# EAGLE design ver1 (EAGLE 9.0.0)
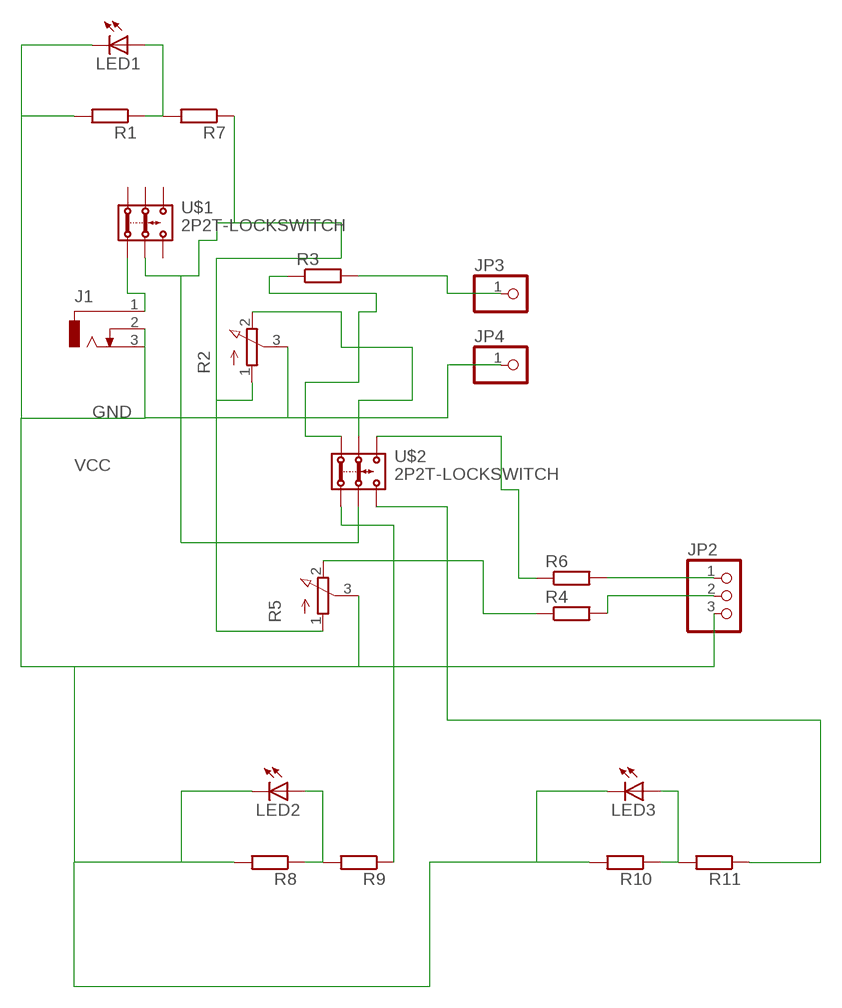
[diagram p0: schematic, sheet 1]

## Parts
J1  DCJ0303  [DCJ0303]
JP2  PINHD-1X3  [1X03]
JP3  PINHD-1X11X01_CHANDIMA  [1X01_CHANDIMA]
JP4  PINHD-1X11X01_CHANDIMA  [1X01_CHANDIMA]
LED1  LEDLED5MM-CHANDIMA  [LED5MM-CHANDIMA]
LED2  LEDLED5MM-CHANDIMA  [LED5MM-CHANDIMA]
LED3  LEDLED5MM-CHANDIMA  [LED5MM-CHANDIMA]
R1  R-EU_0207/10_CHANDIMA  [0207/10_CHANDIMA]
R2  3RP/1610N3RP_CHANDIMA  [3RP/1610N_CHANDIMA]
R3  R-EU_0207/10_CHANDIMA  [0207/10_CHANDIMA]
R4  R-EU_0207/10_CHANDIMA  [0207/10_CHANDIMA]
R5  3RP/1610N3RP_CHANDIMA  [3RP/1610N_CHANDIMA]
R6  R-EU_0207/10_CHANDIMA  [0207/10_CHANDIMA]
R7  R-EU_0207/10_CHANDIMA  [0207/10_CHANDIMA]
R8  R-EU_0207/10_CHANDIMA  [0207/10_CHANDIMA]
R9  R-EU_0207/10_CHANDIMA  [0207/10_CHANDIMA]
R10  R-EU_0207/10_CHANDIMA  [0207/10_CHANDIMA]
R11  R-EU_0207/10_CHANDIMA  [0207/10_CHANDIMA]
U$1  2P2T-LOCKSWITCH  [2P2T-LOCKSWITCH]
U$2  2P2T-LOCKSWITCH  [2P2T-LOCKSWITCH]

## Nets
GND: J1.2 J1.3 JP2.3 JP4.1 LED1.K(C) LED2.K(C) LED3.K(C) R1.2 R2.3(S) R5.3(S) R8.2 R10.2
N$1: R2.2(E) U$2.2.1
N$2: LED1.A R1.1 R7.2
N$3: R6.1 U$2.3.1
N$4: J1.1 U$1.1.2
N$5: JP3.1 R3.2
N$6: LED3.A R10.1 R11.2
N$7: JP2.1 R6.2
N$8: R3.1 U$2.1.1
N$9: JP2.2 R4.2
N$10: R4.1 R5.2(E)
N$11: R9.1 U$2.1.2
N$12: LED2.A R8.1 R9.2
N$13: R11.1 U$2.3.2
VCC: R2.1(A) R5.1(A) R7.1 U$1.2.2 U$2.2.2
Unconnected: U$1.1.1 U$1.2.1 U$1.3.1 U$1.3.2

## Library data of the parts
J1 = con-jack:DCJ0303: DC POWER JACK Source: DCJ0303.pdf; OC_FARNELL: unknown; OC_NEWARK: unknown
JP2 = pinhead:PINHD-1X3: PIN HEADER
JP3 JP4 = pinhead:PINHD-1X1: PIN HEADER
LED1-LED3 = led:LED: LED OSRAM: - CHIPLED LG R971, LG N971, LY N971, LG Q971, LY Q971, LO R971, LY R971 LH N974, LH R974 LS Q976, LO Q976, LY Q976 LO Q996 - Hyper CHIPLED LW Q18S LB Q993, LB Q99A, LB R99A - SideLED LS A670, LO A670, LY A670, LG A670, LP A670 LB A673, LV A673, LT A673, LW A673 LH A674 LY A675 LS A676, LA A676, LO A676, LY A676, LW A676 LS A679, LY A679, LG A679 - Hyper Micro SIDELED® LS Y876, LA Y876, LO Y876, LY Y876 LT Y87S - SmartLED LW L88C, LW L88S LB L89C, LB L89S, LG L890 LS L89K, LO L89K, LY L89K LS L896, LA L896, LO L896, LY L896 - TOPLED LS T670, LO T670, LY T670, LG T670, LP T670 LSG T670, LSP T670, LSY T670, LOP T670, LYG T670 LG T671, LOG T671, LSG T671 LB T673, LV T673, LT T673, LW T673 LH T674 LS T676, LA T676, LO T676, LY T676, LB T676, LH T676, LSB T676, LW T676 LB T67C, LV T67C, LT T67C, LS T67K, LO T67K, LY T67K, LW E67C LS E67B, LA E67B, LO E67B, LY E67B, LB E67C, LV E67C, LT E67C LW T67C LS T679, LY T679, LG T679 LS T770, LO T770, LY T770, LG T770, LP T770 LB T773, LV T773, LT T773, LW T773 LH T774 LS E675, LA E675, LY E675, LS T675 LS T776, LA T776, LO T776, LY T776, LB T776 LHGB T686 LT T68C, LB T68C - Hyper Mini TOPLED® LB M676 - Mini TOPLED Santana® LG M470 LS M47K, LO M47K, LY M47K Source: http://www.osram.convergy.de LUXEON: - LUMILED® LXK2-PW12-R00, LXK2-PW12-S00, LXK2-PW14-U00, LXK2-PW14-V00 LXK2-PM12-R00, LXK2-PM12-S00, LXK2-PM14-U00 LXK2-PE12-Q00, LXK2-PE12-R00, LXK2-PE12-S00, LXK2-PE14-T00, LXK2-PE14-U00 LXK2-PB12-K00, LXK2-PB12-L00, LXK2-PB12-M00, LXK2-PB14-N00, LXK2-PB14-P00, LXK2-PB14-Q00 LXK2-PR12-L00, LXK2-PR12-M00, LXK2-PR14-Q00, LXK2-PR14-R00 LXK2-PD12-Q00, LXK2-PD12-R00, LXK2-PD12-S00 LXK2-PH12-R00, LXK2-PH12-S00 LXK2-PL12-P00, LXK2-PL12-Q00, LXK2-PL12-R00 Source: www.luxeon.com KINGBRIGHT: KA-3528ASYC Source: www.kingbright.com
R1 R3 R4 R6-R11 = rcl:R-EU_: RESISTOR, European symbol
R2 R5 = pot:3RP/1610N: 16mm Potentiometer one level Source: http://www.alphapotentiometers.net/html/16mm_pot_2.html
U$1 U$2 = switch:2P2T-LOCKSWITCH

## Net classes
0 default: width 1.016 mm, clearance 1.27 mm

## Board
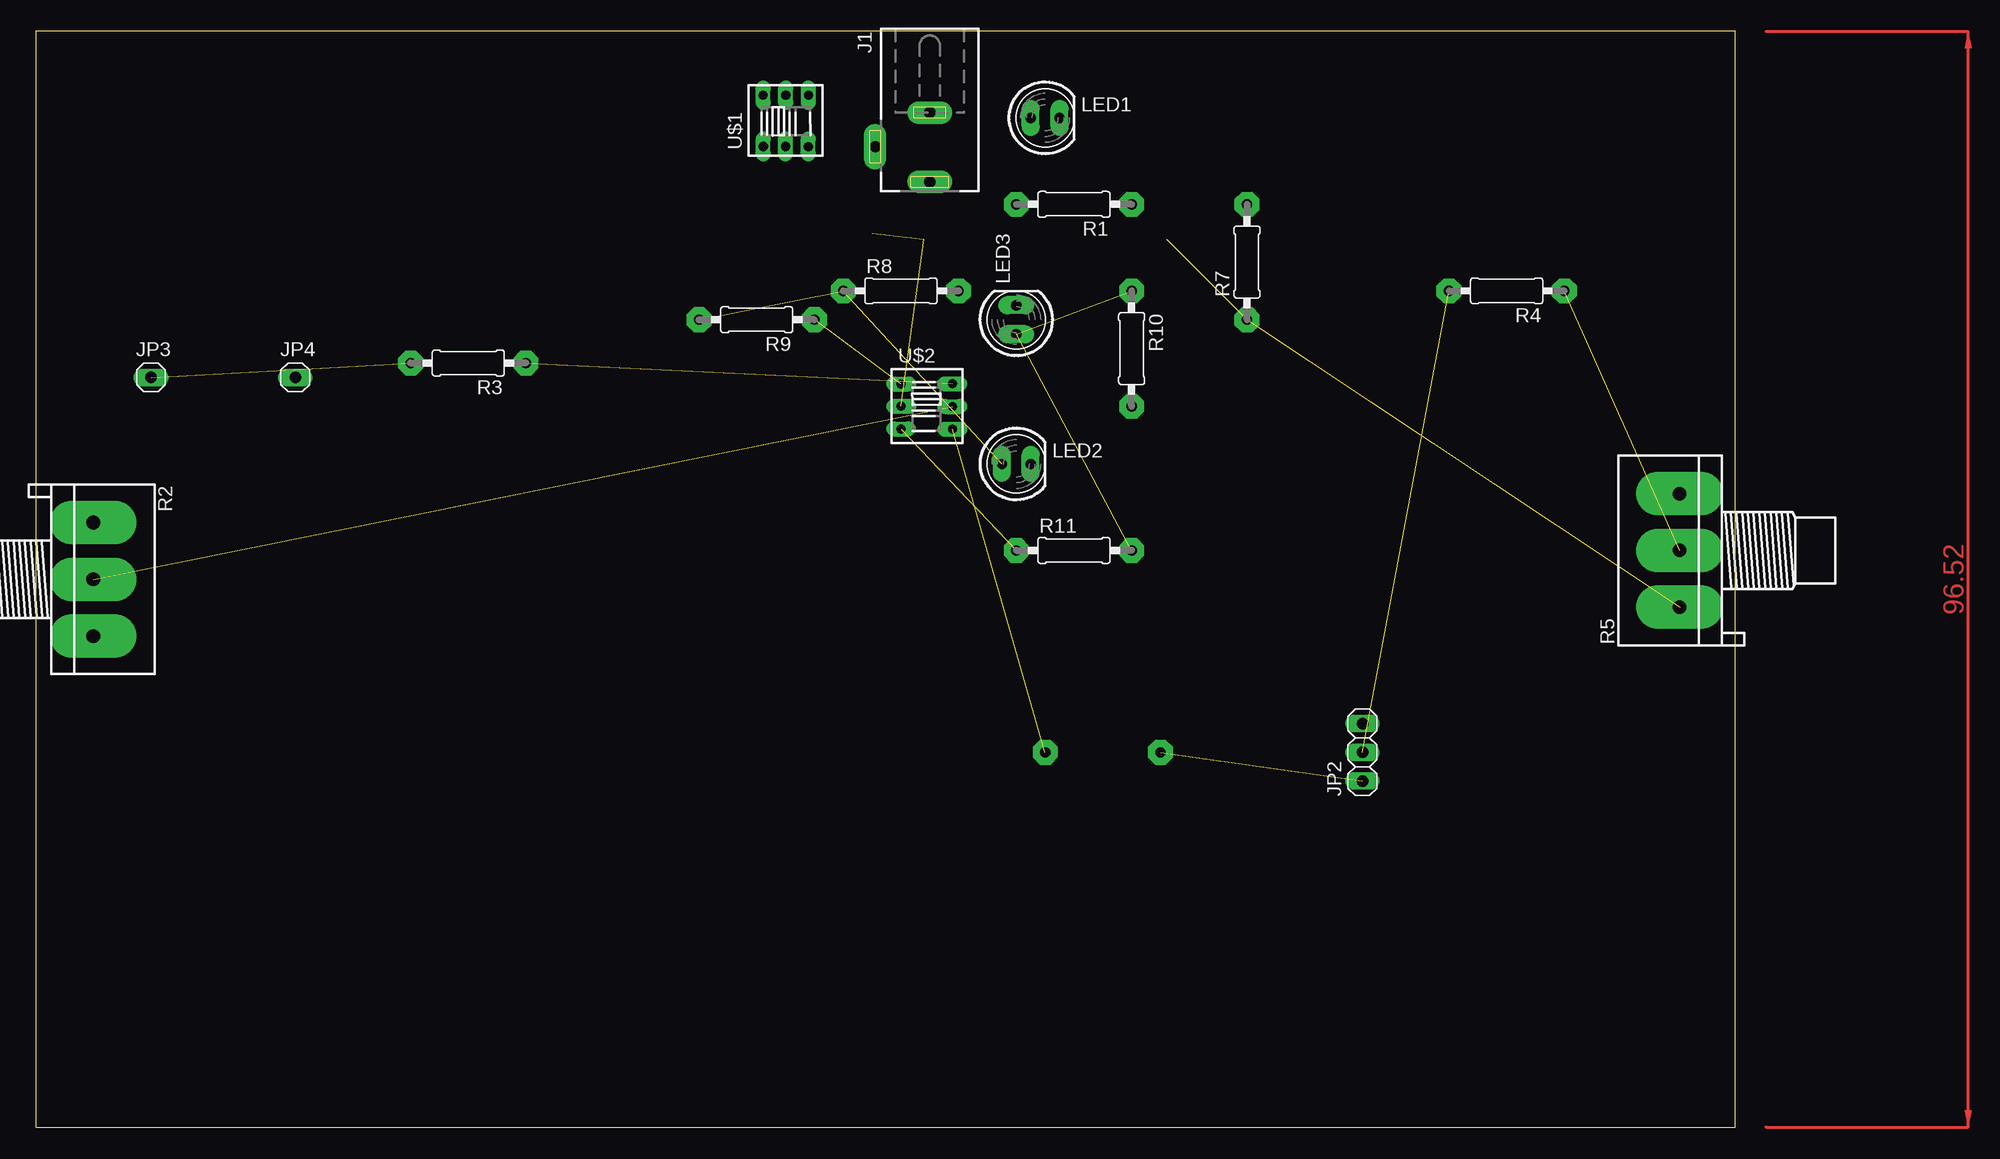
[diagram p1: board, top side]
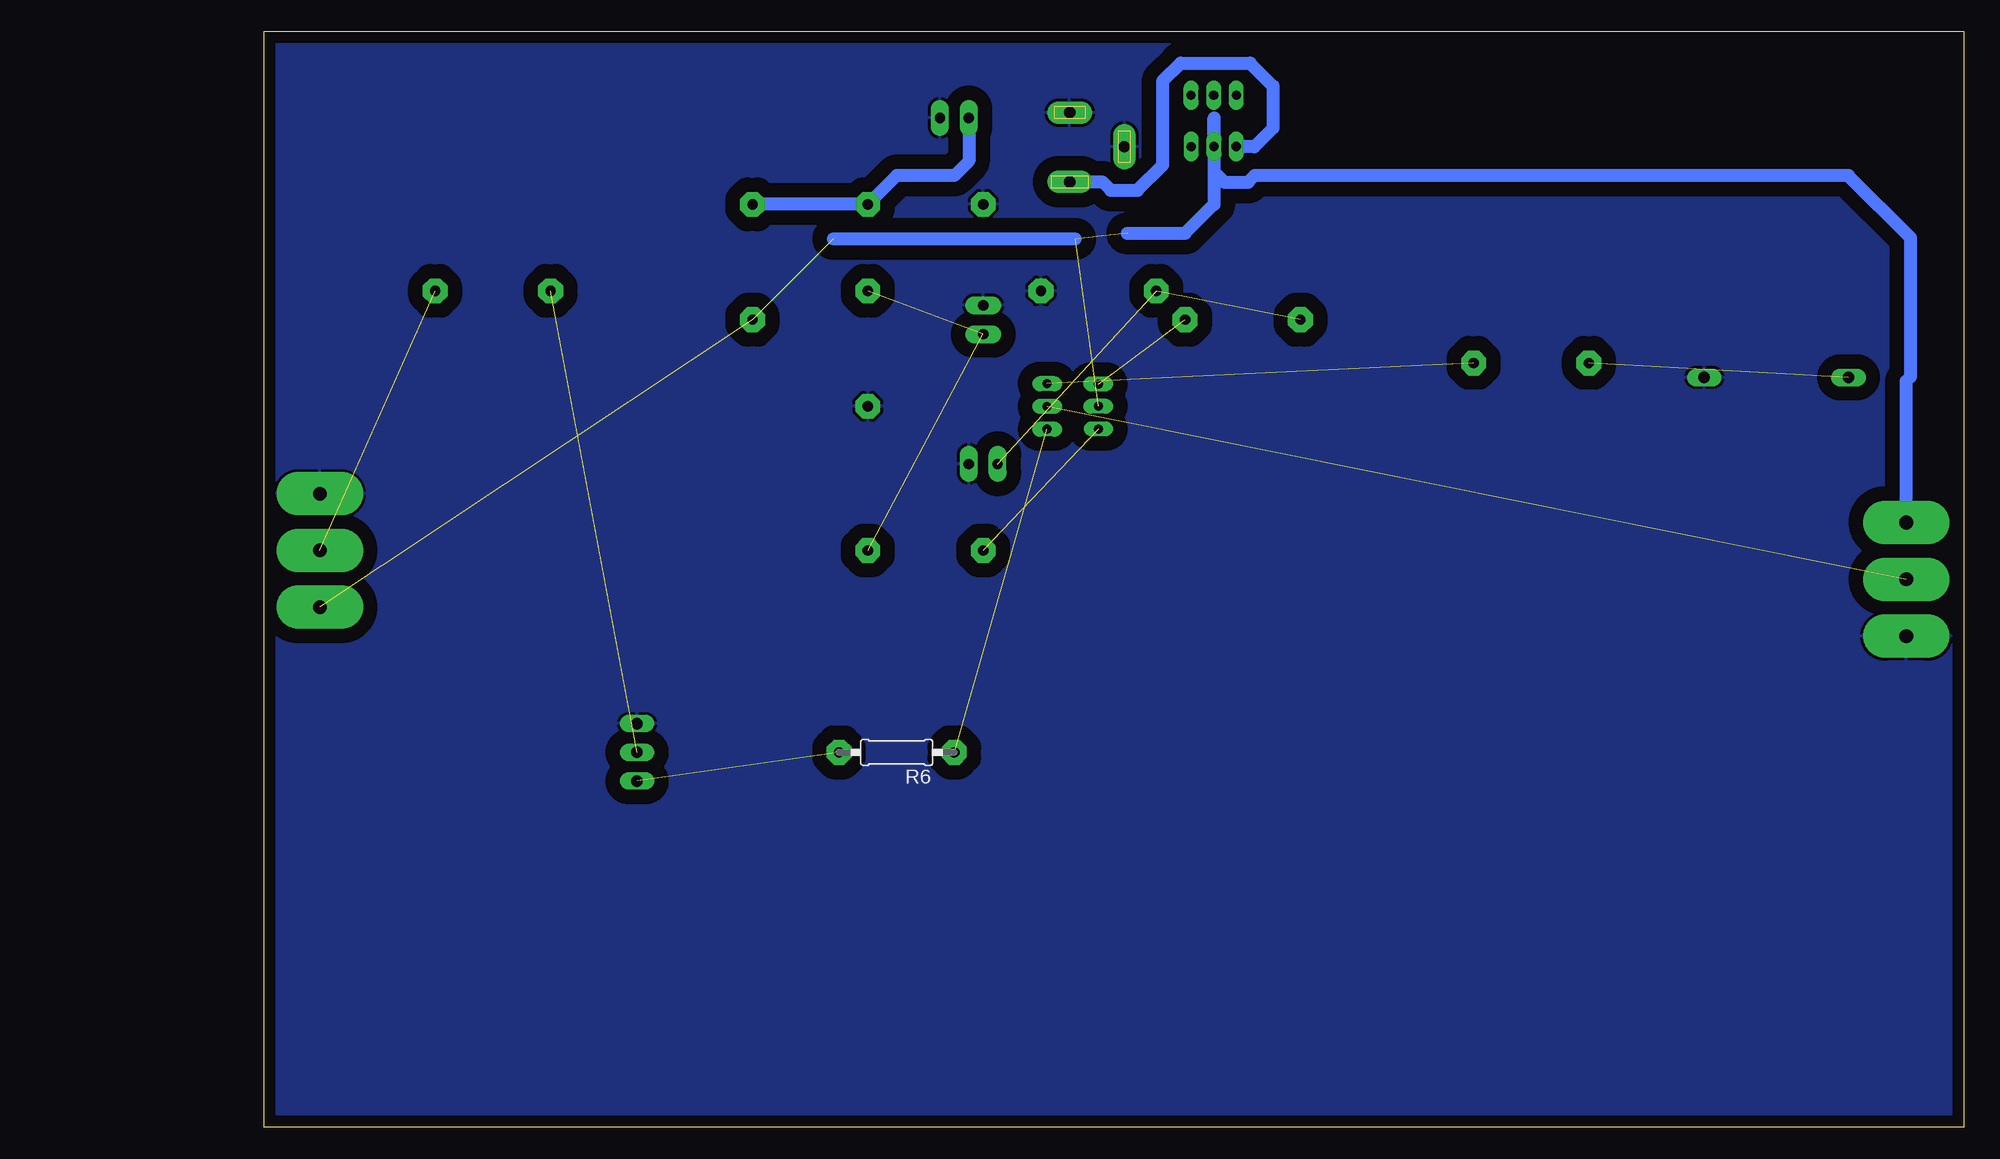
[diagram p2: board, bottom side, seen from below]

Size 149.66 x 96.51 mm. Coordinates in mm from the lower left corner, seen from the top.
Outline: 0,0 149.66,0 149.66,96.51 0,96.51 0,0
Copper layers (1*16): Top 0.035mm / dielectric 1.5mm / Bottom 0.035mm
Design rules "default": minimum track width 6mil, minimum drill 0.35mm, track to track 6mil, track to pad 6mil, pad to pad 6mil, via to via 6mil, smd to smd 6mil, copper to edge 40mil, drill to drill 6mil, minimum pad ring 10mil, minimum via ring 8mil, stop-mask expansion 4mil, vias tented up to drill 0mil, thermal gap 10mil

### Footprints (pad centres in the part's own frame; a part is rotated, then mirrored left to right if it is on the bottom)
DCJ0303 = drill 1 pad 2 long: 1 0,3.1; 2 4.8,0; 3 0,-3
1X03 = drill 1.016 long: 1 -2.54,0; 2 0,0; 3 2.54,0
1X01_CHANDIMA = drill 1.016 long: 1 0,0
LED5MM-CHANDIMA = drill 0.9 pad 1.6 long: A -1.27,0; K 1.27,0
0207/10_CHANDIMA = drill 0.9 pad 2.184 octagon: 1 -5.08,0; 2 5.08,0
3RP/1610N_CHANDIMA = drill 1.2 pad 3.81 long: 1 -5,0; 2 0,0; 3 5,0
2P2T-LOCKSWITCH = drill 0.8 pad 0.965 long: 1.1 -1.98,1.99; 1.2 -1.96,-2.52; 2.1 0.02,1.99; 2.2 -0.01,-2.52; 3.1 2.02,1.99; 3.2 2,-2.53

### Placement (x,y rotation side)
J1  78.74,86.36 180 top
JP2  116.84,33.02 90 top
JP3  10.16,66.04 0 top
JP4  22.86,66.04 0 top
LED1  88.9,88.9 0 top
LED2  86.36,58.42 0 top
LED3  86.36,71.12 90 top
R1  91.44,81.28 180 top
R2  5.08,48.26 270 top
R3  38.1,67.31 180 top
R4  129.54,73.66 180 top
R5  144.78,50.8 90 top
R6  93.98,33.02 180 bottom
R7  106.68,76.2 90 top
R8  76.2,73.66 0 top
R9  63.5,71.12 180 top
R10  96.52,68.58 270 top
R11  91.44,50.8 0 top
U$1  66.04,88.9 0 top
U$2  78.74,63.5 270 top

### Tracks (layer width: path | path; a pad name or v marks a point on that pad's centre or on a via)
GND
  pour Bottom: 0,96.52 149.73,96.52 149.73,94.74 149.73,0 148.97,0 0,0
N$1  (1 unrouted)
N$2
  Bottom 1.143: LED1.A 87.63,85.09 88.9,83.82 93.98,83.82 R1.1 R7.2
N$3  (1 unrouted)
N$4
  Bottom 1.143: J1.1 75.86,83.26 75.12,82.52 72.76,82.52 70.53,84.75 70.53,92.15 68.96,93.73 62.87,93.73 60.83,91.69 60.83,88.01 62.48,86.36 63.5,86.36 63.51,86.36 | 63.51,86.36 63.53,86.38 | U$1.1.2 64.06,86.36 63.51,86.36
N$5  (1 unrouted)
N$6  (2 unrouted)
N$7  (1 unrouted)
N$8  (1 unrouted)
N$9  (1 unrouted)
N$10  (1 unrouted)
N$11  (1 unrouted)
N$12  (2 unrouted)
N$13  (1 unrouted)
VCC  (4 unrouted)
  Bottom 1.143: U$1.2.2 66.04,88.91 66.04,83.82 | 66.04,83.82 66.04,81.28 68.58,78.74 73.66,78.74 | 78.25,78.23 99.57,78.23 | 66.04,83.82 65.7,83.82 65.11,83.23 63.05,83.23 62.46,83.82 10.16,83.82 4.69,78.35 4.69,66.09 5.08,65.7 R2.1
(copper drawn outside any net)
  shapes: Top area x2